# Altium schematic sheet ESP32_Module.SchDoc: ESP32-WROOM32D Module
size A4; DocumentNumber: 14; SheetNumber: 14; SheetTotal: 50
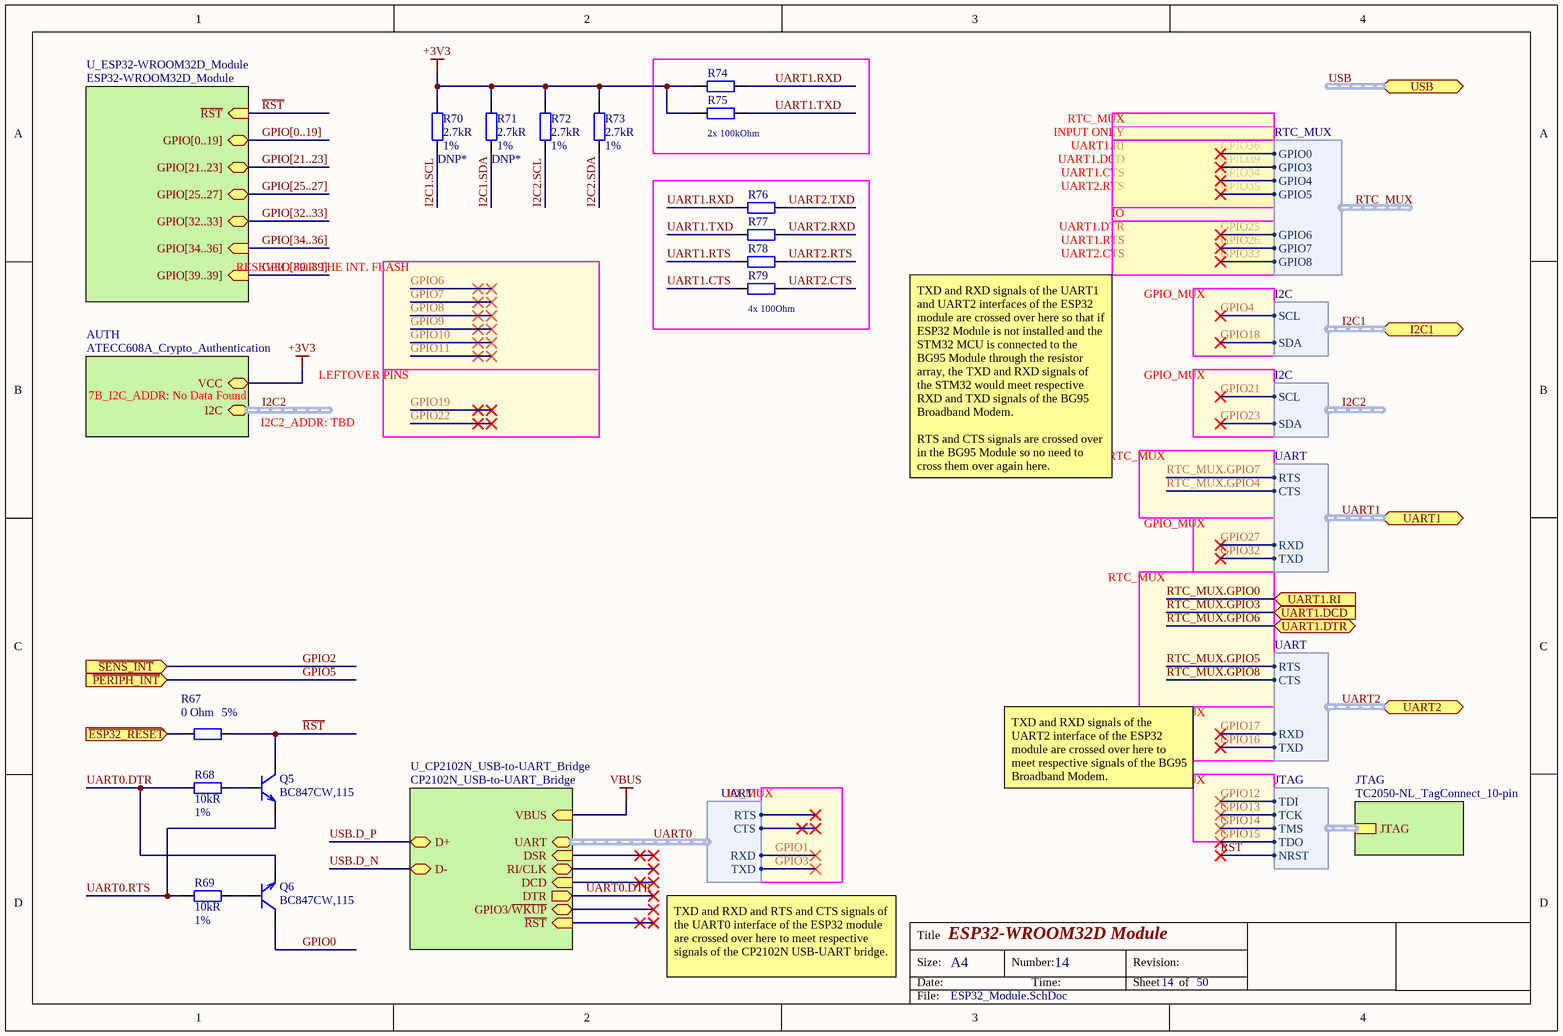
[diagram p0: ESP32_Module.SchDoc]

## Parts
Q5  BC847CW,115  [SOT-323]
Q6  BC847CW,115  [SOT-323]
R67  Tolerance: 5%  Resistance: 0 Ohm  [R0402]  (hidden comment: RES SMD 0 OHM JUMPER 1/16W 0402)
R68  Resistance: 10kR  Tolerance: 1%  [R0402]  (hidden comment: RES SMD 10K OHM 1% 1/16W 0402)
R69  Resistance: 10kR  Tolerance: 1%  [R0402]  (hidden comment: RES SMD 10K OHM 1% 1/16W 0402)
R70  DNP*  Resistance: 2.7kR  Tolerance: 1%  [R0402]  (no BOM)
R71  DNP*  Resistance: 2.7kR  Tolerance: 1%  [R0402]  (no BOM)
R72  Resistance: 2.7kR  Tolerance: 1%  [R0402]  (hidden comment: RES SMD 2.7K OHM 1% 1/16W 0402)
R73  Resistance: 2.7kR  Tolerance: 1%  [R0402]  (hidden comment: RES SMD 2.7K OHM 1% 1/16W 0402)
R74  RES SMD 100K OHM 1% 1/16W 0402  [R0402]  (value not drawn)
R75  RES SMD 100K OHM 1% 1/16W 0402  [R0402]  (value not drawn)
R76  RES SMD 100 OHM 1% 1/16W 0402  [R0402]  (value not drawn)
R77  RES SMD 100 OHM 1% 1/16W 0402  [R0402]  (value not drawn)
R78  RES SMD 100 OHM 1% 1/16W 0402  [R0402]  (value not drawn)
R79  RES SMD 100 OHM 1% 1/16W 0402  [R0402]  (value not drawn)

## Blocks framed on the sheet
2x 100kOhm: R74 R75
4x 100Ohm: R76-R79

## Sub-sheets
AUTH = ATECC608A_Crypto_Authentication: I2C (harness I2C), VCC  | 7B_I2C_ADDR: No Data Found; I2C2_ADDR: TBD
JTAG = TC2050-NL_TagConnect_10-pin: JTAG (harness JTAG)  | Caption: JTAG
U_CP2102N_USB-to-UART_Bridge = CP2102N_USB-to-UART_Bridge: VBUS (in), D+ (bidir), D- (bidir), GPIO3/~{WKUP} (bidir), ~{RST} (in), UART (harness UART), DCD (in), RI/CLK (bidir), DTR (out), DSR (in)
U_ESP32-WROOM32D_Module = ESP32-WROOM32D_Module: ~{RST} (in), GPIO[39..39] (in), GPIO[0..19], GPIO[21..23], GPIO[25..27], GPIO[32..33], GPIO[34..36] (in)

## Ports
I2C1 (harness I2C), UART1 (harness UART), UART1.DCD (in), UART1.DTR (bidir), UART1.RI (in), UART2 (harness UART), USB (harness USB), ~{ESP32_RESET} (in), ~{PERIPH_INT} (in), ~{SENS_INT} (in)

## Harnesses
I2C: SCL, SDA
JTAG: TDI, TMS, TCK, TDO, NRST
UART: RTS, CTS, RXD, TXD
RTC_MUX: GPIO0, GPIO3, GPIO4, GPIO5, GPIO6, GPIO7, GPIO8

## Nets
+3V3: R70.2 R71.2 R72.2 R73.2 R74.1 R75.1 ; sheet AUTH/VCC
VBUS: sheet U_CP2102N_USB-to-UART_Bridge/VBUS
~{ESP32_RESET}: R67.1 ; port ~{ESP32_RESET}
~{RST}: Q5.3(C) R67.2 ; sheet U_ESP32-WROOM32D_Module/~{RST}, sheet JTAG/JTAG.NRST
GPIO0: Q6.3(C)
GPIO1: sheet U_CP2102N_USB-to-UART_Bridge/UART.RXD
GPIO2: port ~{SENS_INT}
GPIO3: sheet U_CP2102N_USB-to-UART_Bridge/UART.TXD
GPIO4: port I2C1.SCL
GPIO5: port ~{PERIPH_INT}
GPIO12: sheet JTAG/JTAG.TDI
GPIO13: sheet JTAG/JTAG.TCK
GPIO14: sheet JTAG/JTAG.TMS
GPIO15: sheet JTAG/JTAG.TDO
GPIO16: port UART2.TXD
GPIO17: port UART2.RXD
GPIO18: port I2C1.SDA
GPIO21: sheet AUTH/I2C.SCL
GPIO23: sheet AUTH/I2C.SDA
GPIO25: harness RTC_MUX.GPIO6
GPIO26: harness RTC_MUX.GPIO7
GPIO27: port UART1.RXD
GPIO32: port UART1.TXD
GPIO33: harness RTC_MUX.GPIO8
GPIO34: harness RTC_MUX.GPIO4
GPIO35: harness RTC_MUX.GPIO5
GPIO36: harness RTC_MUX.GPIO0
GPIO39: harness RTC_MUX.GPIO3
I2C1.SCL: R70.1
I2C1.SDA: R71.1
I2C2.SCL: R72.1
I2C2.SDA: R73.1
RTC_MUX.GPIO0: port UART1.RI
RTC_MUX.GPIO3: port UART1.DCD
RTC_MUX.GPIO4: port UART1.CTS
RTC_MUX.GPIO5: port UART2.RTS
RTC_MUX.GPIO6: port UART1.DTR
RTC_MUX.GPIO7: port UART1.RTS
RTC_MUX.GPIO8: port UART2.CTS
UART0.DTR: Q6.2(E) R68.1 ; sheet U_CP2102N_USB-to-UART_Bridge/DTR
UART0.RTS: Q5.2(E) R69.1
UART1.CTS: R79.2
UART1.RTS: R78.2
UART1.RXD: R74.2 R76.2
UART1.TXD: R75.2 R77.2
UART2.CTS: R79.1
UART2.RTS: R78.1
UART2.RXD: R77.1
UART2.TXD: R76.1
USB.D_N: sheet U_CP2102N_USB-to-UART_Bridge/D-
USB.D_P: sheet U_CP2102N_USB-to-UART_Bridge/D+
NetQ5_1: Q5.1(B) R68.2
NetQ6_1: Q6.1(B) R69.2

## Buses and harness runs
bus GPIO[0..19] = sheet U_ESP32-WROOM32D_Module/GPIO[0..19]
bus GPIO[21..23] = sheet U_ESP32-WROOM32D_Module/GPIO[21..23]
bus GPIO[25..27] = sheet U_ESP32-WROOM32D_Module/GPIO[25..27]
bus GPIO[32..33] = sheet U_ESP32-WROOM32D_Module/GPIO[32..33]
bus GPIO[34..36] = sheet U_ESP32-WROOM32D_Module/GPIO[34..36]
bus GPIO[39..39] = sheet U_ESP32-WROOM32D_Module/GPIO[39..39]
harness I2C1 = port I2C1
harness I2C2 = sheet AUTH/I2C
harness UART0 = sheet U_CP2102N_USB-to-UART_Bridge/UART
harness UART1 = port UART1
harness UART2 = port UART2
harness USB = port USB

## Notes on the sheet
- INPUT ONLY
- UART1.RI
- UART1.DCD
- UART1.CTS
- RTC_MUX
- IO
- UART1.DTR
- UART2.RTS
- UART1.RTS
- RESEVED FOR THE INT. FLASH
- UART2.CTS
- GPIO_MUX
- LEFTOVER PINS
- TXD and RXD signals of the UART1 and UART2 interfaces of the ESP32 module are crossed over here so that if ESP32 Module is not installed and the STM32 MCU is connected to the BG95 Module through the resistor array, the TXD and RXD signals of the STM32 would meet respective RXD and TXD signals of the BG95 Broadband Modem.
  RTS and CTS signals are crossed over in the BG95 Module so no need to cross them over again here.
- IO_MUX
- TXD and RXD signals of the UART2 interface of the ESP32 module are crossed over here to meet respective signals of the BG95 Broadband Modem.
- TXD and RXD and RTS and CTS signals of the UART0 interface of the ESP32 module are crossed over here to meet respective signals of the CP2102N USB-UART bridge.
- Title
- Size:
- Date:
- A4
- Number:
- Time:
- Revision:
- Sheet
- of
- File:

## Library data of the parts
Q5 Q6 = TRANS BC847CW,115 NPN 45V 0.1A SOT323: Bipolar (BJT) Transistor NPN 45V 100mA 100MHz 200mW Surface Mount SOT-323-3; Manufacturer: Nexperia; Supplier 1: Digi-Key; Manufacturer Part Number: BC847CW,115; Stock 1: 327256; Pricing 1: 1=0.13, 10=0.118, 25=0.1124, 100=0.0495, 250=0.0475, 500=0.0389, 1000=0.027 (USD); ComponentLink1URL: http://www.farnell.com/datasheets/1856333.pdf?src-supplier=Farnell; ComponentLink1Description: http://www.farnell.com/datasheets/1856333.pdf?src-supplier=Farnell; ComponentLink2URL: http://www.farnell.com/datasheets/1856333.pdf?src-supplier=Element14; ComponentLink2Description: http://www.farnell.com/datasheets/1856333.pdf?src-supplier=Element14; ComponentLink3URL: https://assets.nexperia.com/documents/data-sheet/BC847_SER.pdf?src-supplier=Digi-Key; ComponentLink3Description: https://assets.nexperia.com/documents/data-sheet/BC847_SER.pdf?src-supplier=Digi-Key; ComponentLink4URL: http://www.farnell.com/datasheets/1856333.pdf?src-supplier=Newark; ComponentLink4Description: http://www.farnell.com/datasheets/1856333.pdf?src-supplier=Newark; Supplier Part Number 1: 1727-4312-1-ND; ClassName: U_ESP32-WROOM32D_Module; Mount: Surface Mount
R67 = RES SMD 0 OHM JUMPER 1/16W 0402: 0 Ohms Jumper 0.063W, 1/16W Chip Resistor 0402 (1005 Metric) Moisture Resistant Thick Film; Manufacturer: Yageo; Manufacturer Part Number: RC0402JR-070RL; Power Rating: 62.5mW; Voltage Rating: 50V; Max Power Dissipation: 63mW; Temperature Coefficient: 200ppm/°C; Supplier 1: Digi-Key; Stock 1: 46057148; Pricing 1: 1=0.1, 10=0.013, 25=0.0092, 50=0.0072, 100=0.0053, 250=0.004, 500=0.0032, 1000=0.0024, 5000=0.0017 (USD); Contact Plating: Tin,Matte; Case Code (Metric): 1005; Case Code (Imperial): 0402; Min Operating Temperature: -55°C; Max Operating Temperature: 155°C; Packaging: Tape and Reel; Composition: Thick Film; Package Quantity: 1; Number of Terminations: 2; Termination: SMD/SMT; Military Standard: Not; Features: Moisture Resistant; Length: 1mm; Height: 0.016inch; Width: 0.02inch; Depth: 0.5mm; Radiation Hardening: No; REACH SVHC: Unknown; Lead Free: Lead Free; ComponentLink1URL: http://www.yageo.com/documents/recent/PYu-RC_Group_51_RoHS_L_10.pdf?src-supplier=Digi-Key; ComponentLink1Description: http://www.yageo.com/documents/recent/PYu-RC_Group_51_RoHS_L_10.pdf?src-supplier=Digi-Key; ComponentLink2URL: http://www.yageo.com/documents/recent/PYu-RC0402_51_RoHS_L_6.pdf?src-supplier=Avnet+Europe; ComponentLink2Description: http://www.yageo.com/documents/recent/PYu-RC0402_51_RoHS_L_6.pdf?src-supplier=Avnet+Europe; ComponentLink3URL: http://www.farnell.com/datasheets/1018594.pdf?src-supplier=Element14; ComponentLink3Description: http://www.farnell.com/datasheets/1018594.pdf?src-supplier=Element14; ComponentLink4URL: https://www.verical.com/server-webapp/html/getDatasheet?partID=326379&src-supplier=Verical; ComponentLink4Description: https://www.verical.com/server-webapp/html/getDatasheet?partID=326379&src-supplier=Verical; ComponentLink5URL: http://www.farnell.com/datasheets/2167052.pdf?src-supplier=Element14; ComponentLink5Description: http://www.farnell.com/datasheets/2167052.pdf?src-supplier=Element14; Supplier Part Number 1: 311-0.0JRCT-ND; Case/Package: 0402; ClassName: U_ESP32-WROOM32D_Module; Mount: Surface Mount
R68 R69 = RES SMD 10K OHM 1% 1/16W 0402: 10 kOhms ±1% 0.063W, 1/16W Chip Resistor 0402 (1005 Metric) Moisture Resistant Thick Film; Manufacturer Part Number: RC0402FR-0710KP; Manufacturer: Yageo; Temperature Coefficient: 150ppm/°C; Max Power Dissipation: 63mW; Supplier 1: Digi-Key; Stock 1: 839368; Pricing 1: 1=0.1, 10=0.035, 100=0.014, 1000=0.0063, 2500=0.0055, 5000=0.0045 (USD); Case Code (Imperial): 0402; Case Code (Metric): 1005; Min Operating Temperature: -55°C; Max Operating Temperature: 155°C; Composition: Thick Film; Packaging: Tape and Reel; Number of Terminations: 2; Length: 0.039inch; Height: 0.016inch; Width: 0.02inch; ComponentLink1URL: http://www.yageo.com/NewPortal/yageodocoutput?fileName=/pdf/R-Chip/PYu-RC_51_RoHS_P_0.pdf&src-supplier=Digi-Key; ComponentLink1Description: http://www.yageo.com/NewPortal/yageodocoutput?fileName=/pdf/R-Chip/PYu-RC_51_RoHS_P_0.pdf&src-supplier=Digi-Key; Supplier Part Number 1: YAG1249CT-ND; Case/Package: 0402; Features: Moisture Resistant; ClassName: U_ESP32-WROOM32D_Module; Mount: Surface Mount
R70-R73 = RES SMD 2.7K OHM 1% 1/16W 0402: 2.7 kOhms ±1% 0.063W, 1/16W Chip Resistor 0402 (1005 Metric) Moisture Resistant Thick Film; Manufacturer Part Number: RC0402FR-072K7L; Manufacturer: Yageo; Temperature Coefficient: 100ppm/°C; Voltage Rating: 50V; Power Rating: 63mW; Supplier 1: Digi-Key; Stock 1: 261850; Pricing 1: 1=0.1, 10=0.016, 100=0.0064, 1000=0.0029, 2500=0.0025, 5000=0.0021 (USD); Case Code (Imperial): 0402; Case Code (Metric): 1005; Min Operating Temperature: -55°C; Max Operating Temperature: 155°C; Composition: Thick Film; Packaging: Tape and Reel; Termination: SMD/SMT; Military Standard: Not; Working Voltage: 50V; Number of Terminations: 2; Length: 1mm; Height: 0.016inch; Width: 0.02inch; Depth: 0.5mm; REACH SVHC: Unknown; Lead Free: Lead Free; ComponentLink1URL: http://www.mouser.com/ds/2/447/PYu-RC0402_51_RoHS_L_6_r-8721.pdf?src-supplier=Mouser; ComponentLink1Description: http://www.mouser.com/ds/2/447/PYu-RC0402_51_RoHS_L_6_r-8721.pdf?src-supplier=Mouser; ComponentLink2URL: http://www.yageo.com/documents/recent/PYu-RC_Group_51_RoHS_L_9.pdf?src-supplier=Digi-Key; ComponentLink2Description: http://www.yageo.com/documents/recent/PYu-RC_Group_51_RoHS_L_9.pdf?src-supplier=Digi-Key; ComponentLink3URL: http://www.yageo.com/documents/recent/PYu-RC_Group_51_RoHS_L_10.pdf?src-supplier=Digi-Key; ComponentLink3Description: http://www.yageo.com/documents/recent/PYu-RC_Group_51_RoHS_L_10.pdf?src-supplier=Digi-Key; ComponentLink4URL: http://www.farnell.com/datasheets/2167052.pdf?src-supplier=Element14; ComponentLink4Description: http://www.farnell.com/datasheets/2167052.pdf?src-supplier=Element14; Supplier Part Number 1: 311-2.70KLRCT-ND; Case/Package: 0402; Package Quantity: 1; Max Power Dissipation: 63mW; Features: Moisture Resistant; ClassName: U_ESP32-WROOM32D_Module
  R72 R73: Mount: Surface Mount
R74 R75 = RES SMD 100K OHM 1% 1/16W 0402: 100 kOhms ±1% 0.063W, 1/16W Chip Resistor 0402 (1005 Metric) Moisture Resistant Thick Film; Manufacturer: Yageo; Manufacturer Part Number: RC0402FR-07100KL; Temperature Coefficient: 100ppm/°C; Power Rating: 63mW; Voltage Rating: 50V; Supplier 1: Digi-Key; Stock 1: 47448883; Pricing 1: 1=0.1, 10=0.016, 100=0.0064, 1000=0.0029, 2500=0.0025, 5000=0.0021 (USD); Case Code (Metric): 1005; Case Code (Imperial): 0402; Min Operating Temperature: -55°C; Max Operating Temperature: 155°C; Composition: Thick Film; Packaging: Tape and Reel; Package Quantity: 1; Number of Terminations: 2; Termination: SMD/SMT; Military Standard: Not; Max Power Dissipation: 63mW; Working Voltage: 50V; Features: Moisture Resistant; Length: 0.039inch; Height: 0.016inch; Width: 0.02inch; Depth: 0.5mm; REACH SVHC: No SVHC; Lead Free: Lead Free; ComponentLink1URL: http://www.yageo.com/documents/recent/PYu-RC_Group_51_RoHS_L_10.pdf?src-supplier=Digi-Key; ComponentLink1Description: http://www.yageo.com/documents/recent/PYu-RC_Group_51_RoHS_L_10.pdf?src-supplier=Digi-Key; ComponentLink2URL: http://www.farnell.com/datasheets/1018594.pdf?src-supplier=Element14; ComponentLink2Description: http://www.farnell.com/datasheets/1018594.pdf?src-supplier=Element14; ComponentLink3URL: http://www.yageo.com/documents/recent/PYu-RC_Group_51_RoHS_L_9.pdf?src-supplier=Verical; ComponentLink3Description: http://www.yageo.com/documents/recent/PYu-RC_Group_51_RoHS_L_9.pdf?src-supplier=Verical; ComponentLink4URL: http://www.yageo.com/documents/recent/PYu-RC_Group_51_RoHS_L_9.pdf?src-supplier=Mouser; ComponentLink4Description: http://www.yageo.com/documents/recent/PYu-RC_Group_51_RoHS_L_9.pdf?src-supplier=Mouser; ComponentLink5URL: http://documents.rs-components.com/techlib://itc_doclist_GB.htm?stockno=6185797&src-supplier=RSComponents; ComponentLink5Description: http://documents.rs-components.com/techlib://itc_doclist_GB.htm?stockno=6185797&src-supplier=RSComponents; Supplier Part Number 1: 311-100KLRDKR-ND; Case/Package: 0402; Tolerance: 1%; Resistance: 100 kOhm; Mount: Surface Mount
R76-R79 = RES SMD 100 OHM 1% 1/16W 0402: 100 Ohms ±1% 0.063W, 1/16W Chip Resistor 0402 (1005 Metric) Moisture Resistant Thick Film; Manufacturer: Yageo; Manufacturer Part Number: RC0402FR-07100RL; Power Rating: 62.5mW; Voltage Rating: 50V; Temperature Coefficient: 100ppm/°C; Resistance: 100R; Supplier 1: Digi-Key; Stock 1: 16989760; Pricing 1: 1=0.1, 10=0.016, 100=0.0064, 1000=0.0029, 2500=0.0025, 5000=0.0021 (USD); Case/Package: 0402; Number of Pins: 2; Case Code (Imperial): 0402; Case Code (Metric): 1005; Min Operating Temperature: -55°C; Max Operating Temperature: 155°C; Voltage Rating (DC): 50V; Packaging: Tape and Reel; Termination: SMD/SMT; Composition: Thick Film; Military Standard: Not; Length: 1mm; Height: 0.32mm; Width: 0.5mm; Depth: 0.5mm; REACH SVHC: No SVHC; Lead Free: Lead Free; ComponentLink1URL: http://www.farnell.com/datasheets/2167052.pdf?src-supplier=Element14; ComponentLink1Description: http://www.farnell.com/datasheets/2167052.pdf?src-supplier=Element14; ComponentLink2URL: http://www.yageo.com/documents/recent/PYu-RC_Group_51_RoHS_L_9.pdf?src-supplier=Mouser; ComponentLink2Description: http://www.yageo.com/documents/recent/PYu-RC_Group_51_RoHS_L_9.pdf?src-supplier=Mouser; ComponentLink3URL: http://www.yageo.com/documents/recent/PYu-RC0402_51_RoHS_L_6_r.pdf?src-supplier=Future+Electronics; ComponentLink3Description: http://www.yageo.com/documents/recent/PYu-RC0402_51_RoHS_L_6_r.pdf?src-supplier=Future+Electronics; ComponentLink4URL: https://www.verical.com/server-webapp/html/getDatasheet?partID=329466&src-supplier=Verical; ComponentLink4Description: https://www.verical.com/server-webapp/html/getDatasheet?partID=329466&src-supplier=Verical; ComponentLink5URL: http://www.farnell.com/datasheets/1018594.pdf?src-supplier=Element14; ComponentLink5Description: http://www.farnell.com/datasheets/1018594.pdf?src-supplier=Element14; ComponentLink6URL: http://documents.rs-components.com/techlib://itc_doclist_GB.htm?stockno=6185810&src-supplier=RSComponents; ComponentLink6Description: http://documents.rs-components.com/techlib://itc_doclist_GB.htm?stockno=6185810&src-supplier=RSComponents; Supplier Part Number 1: 311-100LRDKR-ND; Tolerance: 1%; Mount: Surface Mount